# EAGLE design Decoupling_Board (EAGLE 9.6.2)
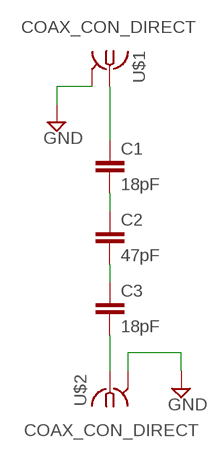
[diagram p0: schematic, sheet 1]

## Parts
C1  18pF  C-EUC1210  [C1210]
C2  47pF  C-EUC1210  [C1210]
C3  18pF  C-EUC1210  [C1210]
U$1  COAX_CON_DIRECT  [COAX.141]
U$2  COAX_CON_DIRECT  [COAX.141]

## Nets
GND: U$1.P$2(GND) U$2.P$2(GND)
N$1: C1.1 U$1.P$1
N$2: C1.2 C2.1
N$3: C2.2 C3.1
N$4: C3.2 U$2.P$1

## Library data of the parts
C1-C3 = rcl:C-EU: CAPACITOR, European symbol; SPICEPREFIX: C
U$1 U$2 = Orzada:COAX_CON_DIRECT: Direct Coax to Bord Top

## Board
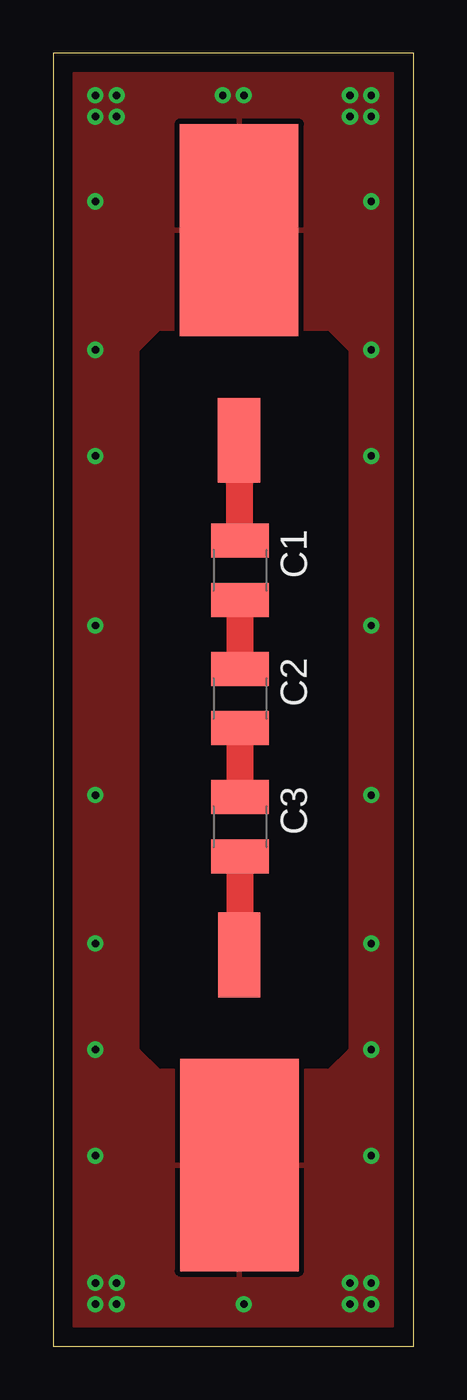
[diagram p1: board, top side]
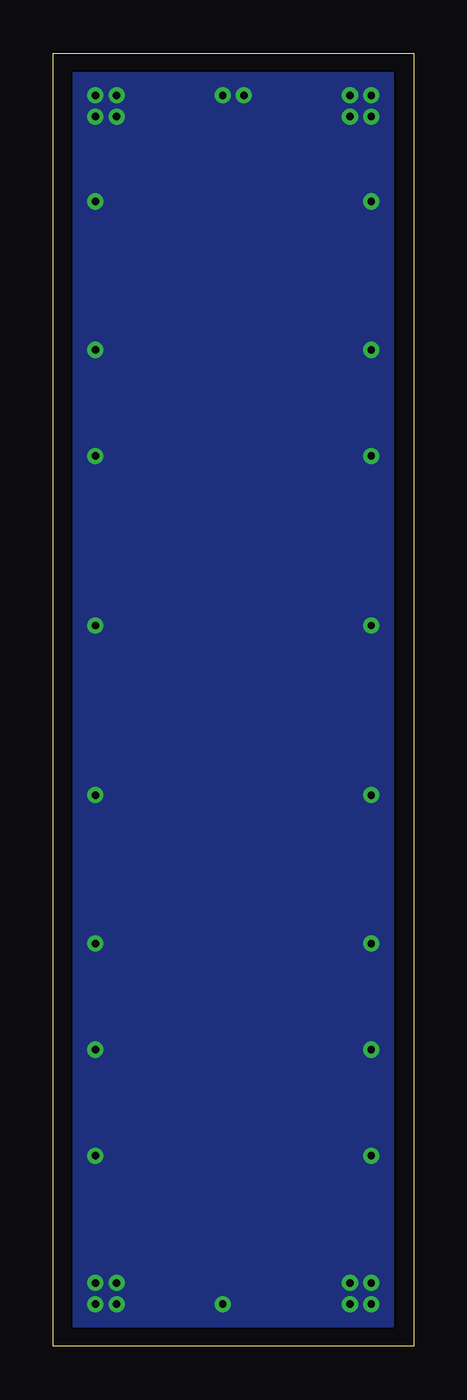
[diagram p2: board, bottom side, seen from below]

Size 17 x 61 mm. Coordinates in mm from the lower left corner, seen from the top.
Outline: 0,0 17,0 17,61 0,61 0,0
Copper layers (1*16): Top 0.035mm / dielectric 0.5mm / Bottom 0.035mm
Design rules "default *": minimum track width 6mil, minimum drill 0.35mm, track to track 6mil, track to pad 6mil, pad to pad 6mil, via to via 6mil, smd to smd 6mil, copper to edge 10mil, drill to drill 6mil, minimum pad ring 10mil, minimum via ring 8mil, stop-mask expansion 4mil, vias tented up to drill 0mil, thermal gap 10mil

### Footprints (pad centres in the part's own frame; a part is rotated, then mirrored left to right if it is on the bottom)
C1210 = smd 1.6 x 2.7: 1 -1.4,0; 2 1.4,0
COAX.141 = smd 4 x 2: P$1 -3.364,0 | smd 10 x 5.588: P$2 6.546,0

### Placement (x,y rotation side)
C1  8.81,36.61 270 top
C2  8.81,30.56 270 top
C3  8.81,24.51 270 top
U$1  8.77,46.1 90 top
U$2  8.78,15.1 270 top

### Tracks (layer width: path | path; a pad name or v marks a point on that pad's centre or on a via)
GND  (via drill 0.35)
  other vias: 2,59 3,59 3,58 2,58 15,59 14,59 14,58 15,58 14,3 15,3 15,2 14,2 2,2 2,3 3,3 3,2 15,47 15,42 15,34 15,26 15,19 15,14 15,9 2,9 2,14 2,19 2,26 2,34 2,42 2,47 2,54 15,54 8,59 9,59 9,2
  pour Top: 1,60 1,1 16,1 16,13 5,13 4,14 4,47 5,48 16,48 16,60
  pour Top: 12,48 13,48 14,47 14,14 13,13 13,12 16,12 16,54 12,54
  pour Bottom: 1,60 16,60 16,1 1,1
N$1
  Top 1.27: U$1.P$1 8.77,38.05 C1.1
N$2
  Top 1.27: C1.2 C2.1
N$3
  Top 1.27: C2.2 C3.1
N$4
  Top 1.27: C3.2 8.81,18.49 U$2.P$1